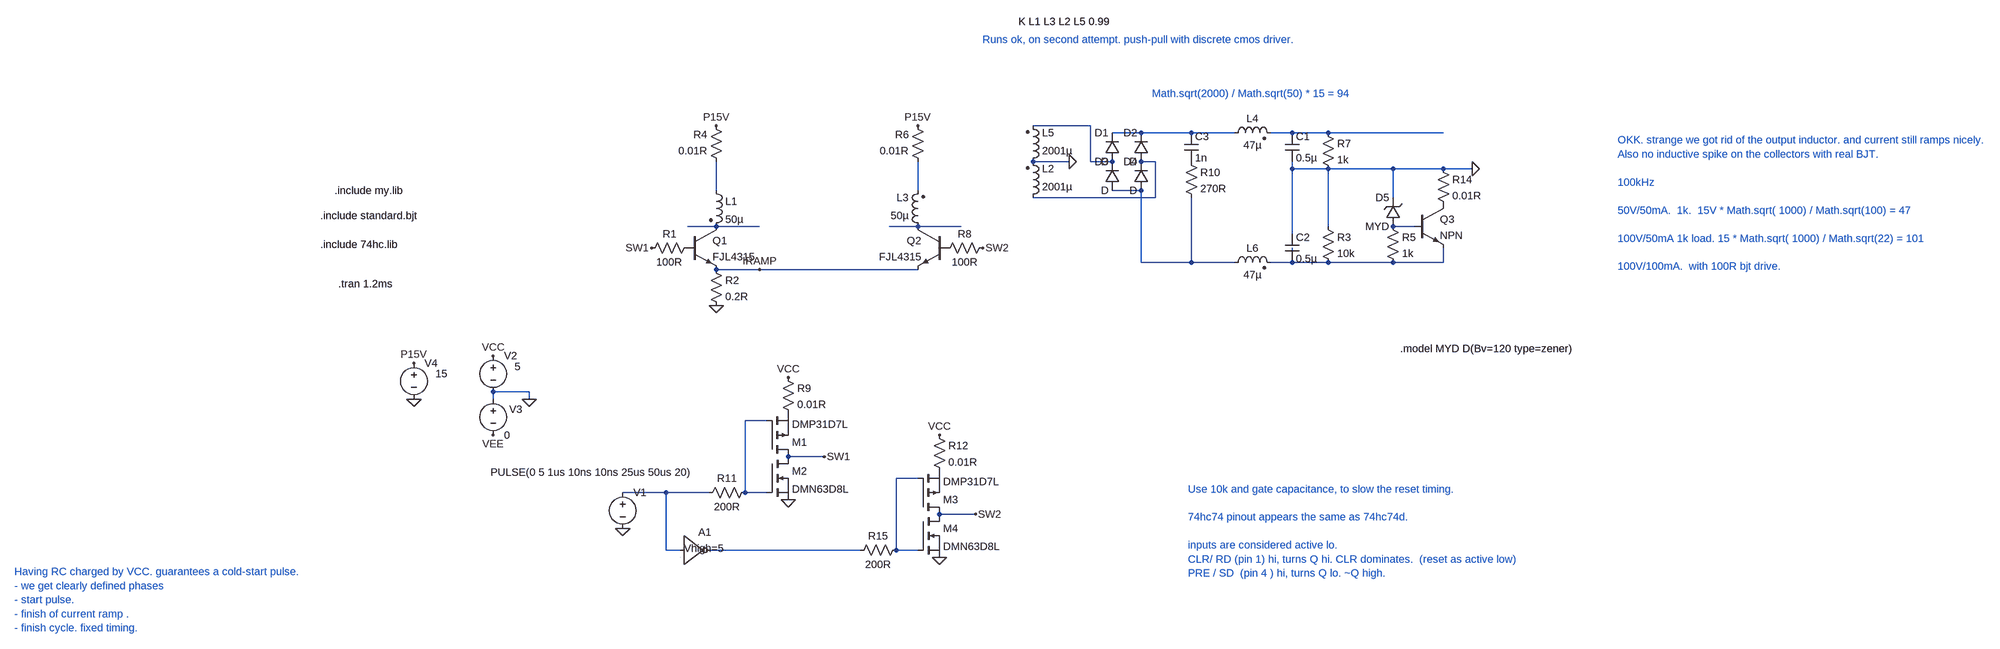
[diagram p0: schematic Draft82.asc]
Draft82.asc, the LTspice schematic file:
Version 4
SHEET 1 4244 1268
WIRE 2064 -640 1936 -640
WIRE 2176 -624 2112 -624
WIRE 2288 -624 2176 -624
WIRE 2384 -624 2288 -624
WIRE 2512 -624 2464 -624
WIRE 2592 -624 2512 -624
WIRE 2848 -624 2592 -624
WIRE 2016 -560 1936 -560
WIRE 2064 -560 2064 -640
WIRE 2112 -560 2064 -560
WIRE 2208 -560 2176 -560
WIRE 2512 -544 2512 -560
WIRE 2592 -544 2512 -544
WIRE 2736 -544 2592 -544
WIRE 2848 -544 2736 -544
WIRE 2912 -544 2848 -544
WIRE 1232 -496 1232 -560
WIRE 1680 -496 1680 -560
WIRE 2176 -496 2112 -496
WIRE 2208 -480 2208 -560
WIRE 2208 -480 1936 -480
WIRE 2736 -480 2736 -544
WIRE 1232 -416 1168 -416
WIRE 1328 -416 1232 -416
WIRE 1680 -416 1616 -416
WIRE 1776 -416 1680 -416
WIRE 2592 -416 2592 -544
WIRE 2784 -416 2736 -416
WIRE 2512 -400 2512 -544
WIRE 2512 -352 2512 -368
WIRE 2176 -336 2176 -496
WIRE 2288 -336 2288 -480
WIRE 2288 -336 2176 -336
WIRE 2384 -336 2288 -336
WIRE 2512 -336 2464 -336
WIRE 2592 -336 2512 -336
WIRE 2736 -336 2592 -336
WIRE 2848 -336 2848 -368
WIRE 2848 -336 2736 -336
WIRE 1328 -320 1232 -320
WIRE 1680 -320 1328 -320
WIRE 816 -48 736 -48
WIRE 736 -32 736 -48
WIRE 816 -32 816 -48
WIRE 1344 16 1296 16
WIRE 1472 96 1392 96
WIRE 1680 144 1632 144
WIRE 1120 176 1024 176
WIRE 1216 176 1120 176
WIRE 1296 176 1296 16
WIRE 1344 176 1296 176
WIRE 1808 224 1728 224
WIRE 1120 304 1120 176
WIRE 1152 304 1120 304
WIRE 1552 304 1216 304
WIRE 1632 304 1632 144
WIRE 1680 304 1632 304
FLAG 816 -32 0
FLAG 736 -128 VCC
FLAG 736 48 VEE
FLAG 560 -32 0
FLAG 560 -112 P15V
FLAG 1232 -240 0
FLAG 1232 -640 P15V
FLAG 1328 -320 IRAMP
FLAG 1088 -368 SW1
FLAG 1680 -640 P15V
FLAG 1824 -368 SW2
FLAG 2912 -544 0
FLAG 2016 -560 0
FLAG 1024 256 0
FLAG 1808 224 SW2
FLAG 1392 -80 VCC
FLAG 1392 192 0
FLAG 1472 96 SW1
FLAG 1728 48 VCC
FLAG 1728 320 0
SYMBOL voltage 736 -144 R0
WINDOW 123 0 0 Left 0
WINDOW 39 0 0 Left 0
WINDOW 3 48 40 Left 2
SYMATTR Value 5
SYMATTR InstName V2
SYMBOL voltage 736 -48 R0
WINDOW 123 0 0 Left 0
WINDOW 39 0 0 Left 0
WINDOW 0 36 39 Left 2
SYMATTR InstName V3
SYMATTR Value 0
SYMBOL voltage 560 -128 R0
WINDOW 123 0 0 Left 0
WINDOW 39 0 0 Left 0
WINDOW 3 48 40 Left 2
SYMATTR Value 15
SYMATTR InstName V4
SYMBOL ind2 1216 -512 R0
SYMATTR InstName L1
SYMATTR Value 50µ
SYMATTR Type ind
SYMBOL npn 1168 -416 R0
SYMATTR InstName Q1
SYMATTR Value FJL4315
SYMBOL res 1216 -336 R0
SYMATTR InstName R2
SYMATTR Value 0.2R
SYMBOL ind2 1920 -464 M180
WINDOW 0 36 80 Left 2
WINDOW 3 36 40 Left 2
SYMATTR InstName L2
SYMATTR Value 2001µ
SYMATTR Type ind
SYMBOL res 1248 -544 R180
WINDOW 0 36 76 Left 2
WINDOW 3 36 40 Left 2
SYMATTR InstName R4
SYMATTR Value 0.01R
SYMBOL ind2 1696 -400 R180
WINDOW 0 36 80 Left 2
WINDOW 3 36 40 Left 2
SYMATTR InstName L3
SYMATTR Value 50µ
SYMATTR Type ind
SYMBOL npn 1744 -416 M0
SYMATTR InstName Q2
SYMATTR Value FJL4315
SYMBOL res 1696 -544 R180
WINDOW 0 36 76 Left 2
WINDOW 3 36 40 Left 2
SYMATTR InstName R6
SYMATTR Value 0.01R
SYMBOL diode 2128 -560 R180
WINDOW 0 24 64 Left 2
WINDOW 3 24 0 Left 2
SYMATTR InstName D1
SYMBOL diode 2192 -560 R180
WINDOW 0 24 64 Left 2
WINDOW 3 24 0 Left 2
SYMATTR InstName D2
SYMBOL diode 2128 -496 R180
WINDOW 0 24 64 Left 2
WINDOW 3 24 0 Left 2
SYMATTR InstName D3
SYMBOL diode 2192 -496 R180
WINDOW 0 24 64 Left 2
WINDOW 3 24 0 Left 2
SYMATTR InstName D4
SYMBOL cap 2496 -624 R0
SYMATTR InstName C1
SYMATTR Value 0.5µ
SYMBOL res 2576 -640 R0
SYMATTR InstName R7
SYMATTR Value 1k
SYMBOL ind2 2368 -608 R270
WINDOW 0 32 56 VTop 2
WINDOW 3 4 56 VBottom 2
SYMATTR InstName L4
SYMATTR Value 47µ
SYMATTR Type ind
SYMBOL ind2 1920 -544 M180
WINDOW 0 36 80 Left 2
WINDOW 3 36 40 Left 2
SYMATTR InstName L5
SYMATTR Value 2001µ
SYMATTR Type ind
SYMBOL ind2 2368 -320 R270
WINDOW 0 32 56 VTop 2
WINDOW 3 4 56 VBottom 2
SYMATTR InstName L6
SYMATTR Value 47µ
SYMATTR Type ind
SYMBOL cap 2496 -400 R0
SYMATTR InstName C2
SYMATTR Value 0.5µ
SYMBOL res 2576 -432 R0
SYMATTR InstName R3
SYMATTR Value 10k
SYMBOL npn 2784 -464 R0
SYMATTR InstName Q3
SYMBOL res 2720 -432 R0
SYMATTR InstName R5
SYMATTR Value 1k
SYMBOL zener 2752 -416 R180
WINDOW 0 24 64 Left 2
WINDOW 3 24 0 Left 2
SYMATTR InstName D5
SYMATTR Value MYD
SYMBOL res 2832 -560 R0
SYMATTR InstName R14
SYMATTR Value 0.01R
SYMBOL voltage 1024 160 R0
WINDOW 123 0 0 Left 0
WINDOW 39 0 0 Left 0
WINDOW 3 -294 -29 Left 2
SYMATTR Value PULSE(0 5 1us 10ns 10ns 25us 50us 20)
SYMATTR InstName V1
SYMBOL Digital\\inv 1152 240 R0
WINDOW 3 8 60 Left 2
SYMATTR Value Vhigh=5
SYMATTR InstName A1
SYMBOL res 1184 -384 R90
WINDOW 0 0 56 VBottom 2
WINDOW 3 32 56 VTop 2
SYMATTR InstName R1
SYMATTR Value 100R
SYMBOL res 1728 -352 R270
WINDOW 0 32 56 VTop 2
WINDOW 3 0 56 VBottom 2
SYMATTR InstName R8
SYMATTR Value 100R
SYMBOL pmos 1344 96 M180
SYMATTR InstName M1
SYMATTR Value DMP31D7L
SYMATTR Prefix X
SYMBOL res 1376 -96 R0
SYMATTR InstName R9
SYMATTR Value 0.01R
SYMBOL nmos 1344 96 R0
SYMATTR InstName M2
SYMATTR Value DMN63D8L
SYMATTR Prefix X
SYMBOL res 1312 160 R90
WINDOW 0 0 56 VBottom 2
WINDOW 3 32 56 VTop 2
SYMATTR InstName R11
SYMATTR Value 200R
SYMBOL pmos 1680 224 M180
SYMATTR InstName M3
SYMATTR Value DMP31D7L
SYMATTR Prefix X
SYMBOL res 1712 32 R0
SYMATTR InstName R12
SYMATTR Value 0.01R
SYMBOL nmos 1680 224 R0
SYMATTR InstName M4
SYMATTR Value DMN63D8L
SYMATTR Prefix X
SYMBOL res 1648 288 R90
WINDOW 0 0 56 VBottom 2
WINDOW 3 32 56 VTop 2
SYMATTR InstName R15
SYMATTR Value 200R
SYMBOL cap 2272 -624 R0
SYMATTR InstName C3
SYMATTR Value 1n
SYMBOL res 2272 -576 R0
SYMATTR InstName R10
SYMATTR Value 270R
TEXT 392 -288 Left 2 !.tran 1.2ms
TEXT 352 -376 Left 2 !.include 74hc.lib
TEXT -328 352 Left 2 ;Having RC charged by VCC. guarantees a cold-start pulse.\n- we get clearly defined phases\n- start pulse.\n- finish of current ramp .\n- finish cycle. fixed timing.
TEXT 2280 168 Left 2 ;Use 10k and gate capacitance, to slow the reset timing.\n \n74hc74 pinout appears the same as 74hc74d.\n \ninputs are considered active lo.\nCLR/ RD (pin 1) hi, turns Q hi. CLR dominates.  (reset as active low)\nPRE / SD  (pin 4 ) hi, turns Q lo. ~Q high.
TEXT 1904 -872 Left 2 !K L1 L3 L2 L5 0.99
TEXT 3352 -608 Left 2 ;OKK. strange we got rid of the output inductor. and current still ramps nicely.\nAlso no inductive spike on the collectors with real BJT.\n \n100kHz\n \n50V/50mA.  1k.  15V * Math.sqrt( 1000) / Math.sqrt(100) = 47\n \n100V/50mA 1k load. 15 * Math.sqrt( 1000) / Math.sqrt(22) = 101\n \n100V/100mA.  with 100R bjt drive.
TEXT 352 -440 Left 2 !.include standard.bjt
TEXT 2752 -144 Left 2 !.model MYD D(Bv=120 type=zener)
TEXT 384 -496 Left 2 !.include my.lib
TEXT 2200 -712 Left 2 ;Math.sqrt(2000) / Math.sqrt(50) * 15 = 94
TEXT 1824 -832 Left 2 ;Runs ok, on second attempt. push-pull with discrete cmos driver.

The netlist it stands for:
* Draft82.asc
V2 VCC 0 5
V3 0 VEE 0
V4 P15V 0 15
L1 N005 N008 50µ
Q1 N008 P001 IRAMP 0 FJL4315
R2 IRAMP 0 0.2R
L2 N004 0 2001µ
R4 N005 P15V 0.01R
L3 N009 N006 50µ
Q2 N009 P002 IRAMP 0 FJL4315
R6 N006 P15V 0.01R
D1 N001 N002 D
D2 N004 N002 D
D3 N007 N001 D
D4 N007 N004 D
C1 N003 0 0.5µ
R7 N003 0 1k
L4 N002 N003 47µ
L5 0 N001 2001µ
L6 N007 N012 47µ
C2 0 N012 0.5µ
R3 0 N012 10k
Q3 P003 N010 N012 0 NPN
R5 N010 N012 1k
D5 N010 0 MYD
R14 0 P003 0.01R
V1 N015 0 PULSE(0 5 1us 10ns 10ns 25us 50us 20)
A1 N015 0 0 0 0 N016 0 0 BUF Vhigh=5
R1 P001 SW1 100R
R8 P002 SW2 100R
XM1 SW1 N013 P004 DMP31D7L  ; pins D G S
R9 VCC P004 0.01R
XM2 SW1 N013 0 DMN63D8L  ; pins D G S
R11 N013 N015 200R
XM3 SW2 N014 P005 DMP31D7L  ; pins D G S
R12 VCC P005 0.01R
XM4 SW2 N014 0 DMN63D8L  ; pins D G S
R15 N014 N016 200R
C3 N002 P006 1n
R10 P006 N007 270R
.model D D
.lib standard.dio
.model NPN NPN
.model PNP PNP
.lib standard.bjt
.tran 1.2ms
.include 74hc.lib
* Having RC charged by VCC. guarantees a cold-start pulse.
* - we get clearly defined phases
* - start pulse.
* - finish of current ramp .
* - finish cycle. fixed timing.
* Use 10k and gate capacitance, to slow the reset timing.
* 74hc74 pinout appears the same as 74hc74d.
* inputs are considered active lo.
* CLR/ RD (pin 1) hi, turns Q hi. CLR dominates.  (reset as active low)
* PRE / SD  (pin 4 ) hi, turns Q lo. ~Q high.
K L1 L3 L2 L5 0.99
* OKK. strange we got rid of the output inductor. and current still ramps nicely.
* Also no inductive spike on the collectors with real BJT.
* 100kHz
* 50V/50mA.  1k.  15V * Math.sqrt( 1000) / Math.sqrt(100) = 47
* 100V/50mA 1k load. 15 * Math.sqrt( 1000) / Math.sqrt(22) = 101
* 100V/100mA.  with 100R bjt drive.
.include standard.bjt
.model MYD D(Bv=120 type=zener)
.include my.lib
* Math.sqrt(2000) / Math.sqrt(50) * 15 = 94
* Runs ok, on second attempt. push-pull with discrete cmos driver.
.backanno
.end